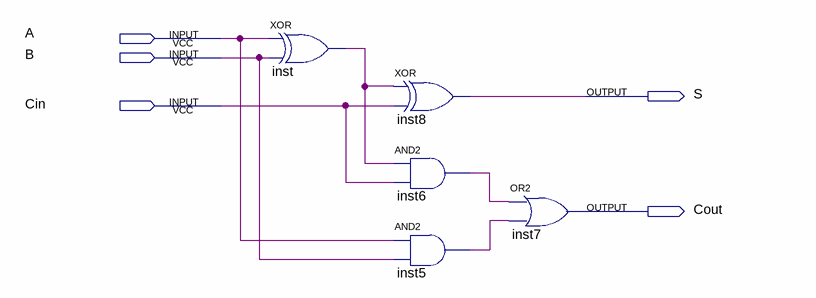
[diagram p0: schematic sheet]
// Quartus schematic Full_Adder.bdf as structural Verilog: 5 symbols, 5 pins
module Full_Adder (
  input  A,
  input  B,
  input  Cin,
  output S,
  output Cout
);

  wire inst5_out, inst6_out, inst_out;

  xor inst (inst_out, A, B);
  xor inst8 (S, inst_out, Cin);
  and inst6 (inst6_out, inst_out, Cin);
  and inst5 (inst5_out, A, B);
  or inst7 (Cout, inst6_out, inst5_out);
endmodule
